# EAGLE design adcmp572-tdr-head (EAGLE 9.5.0)
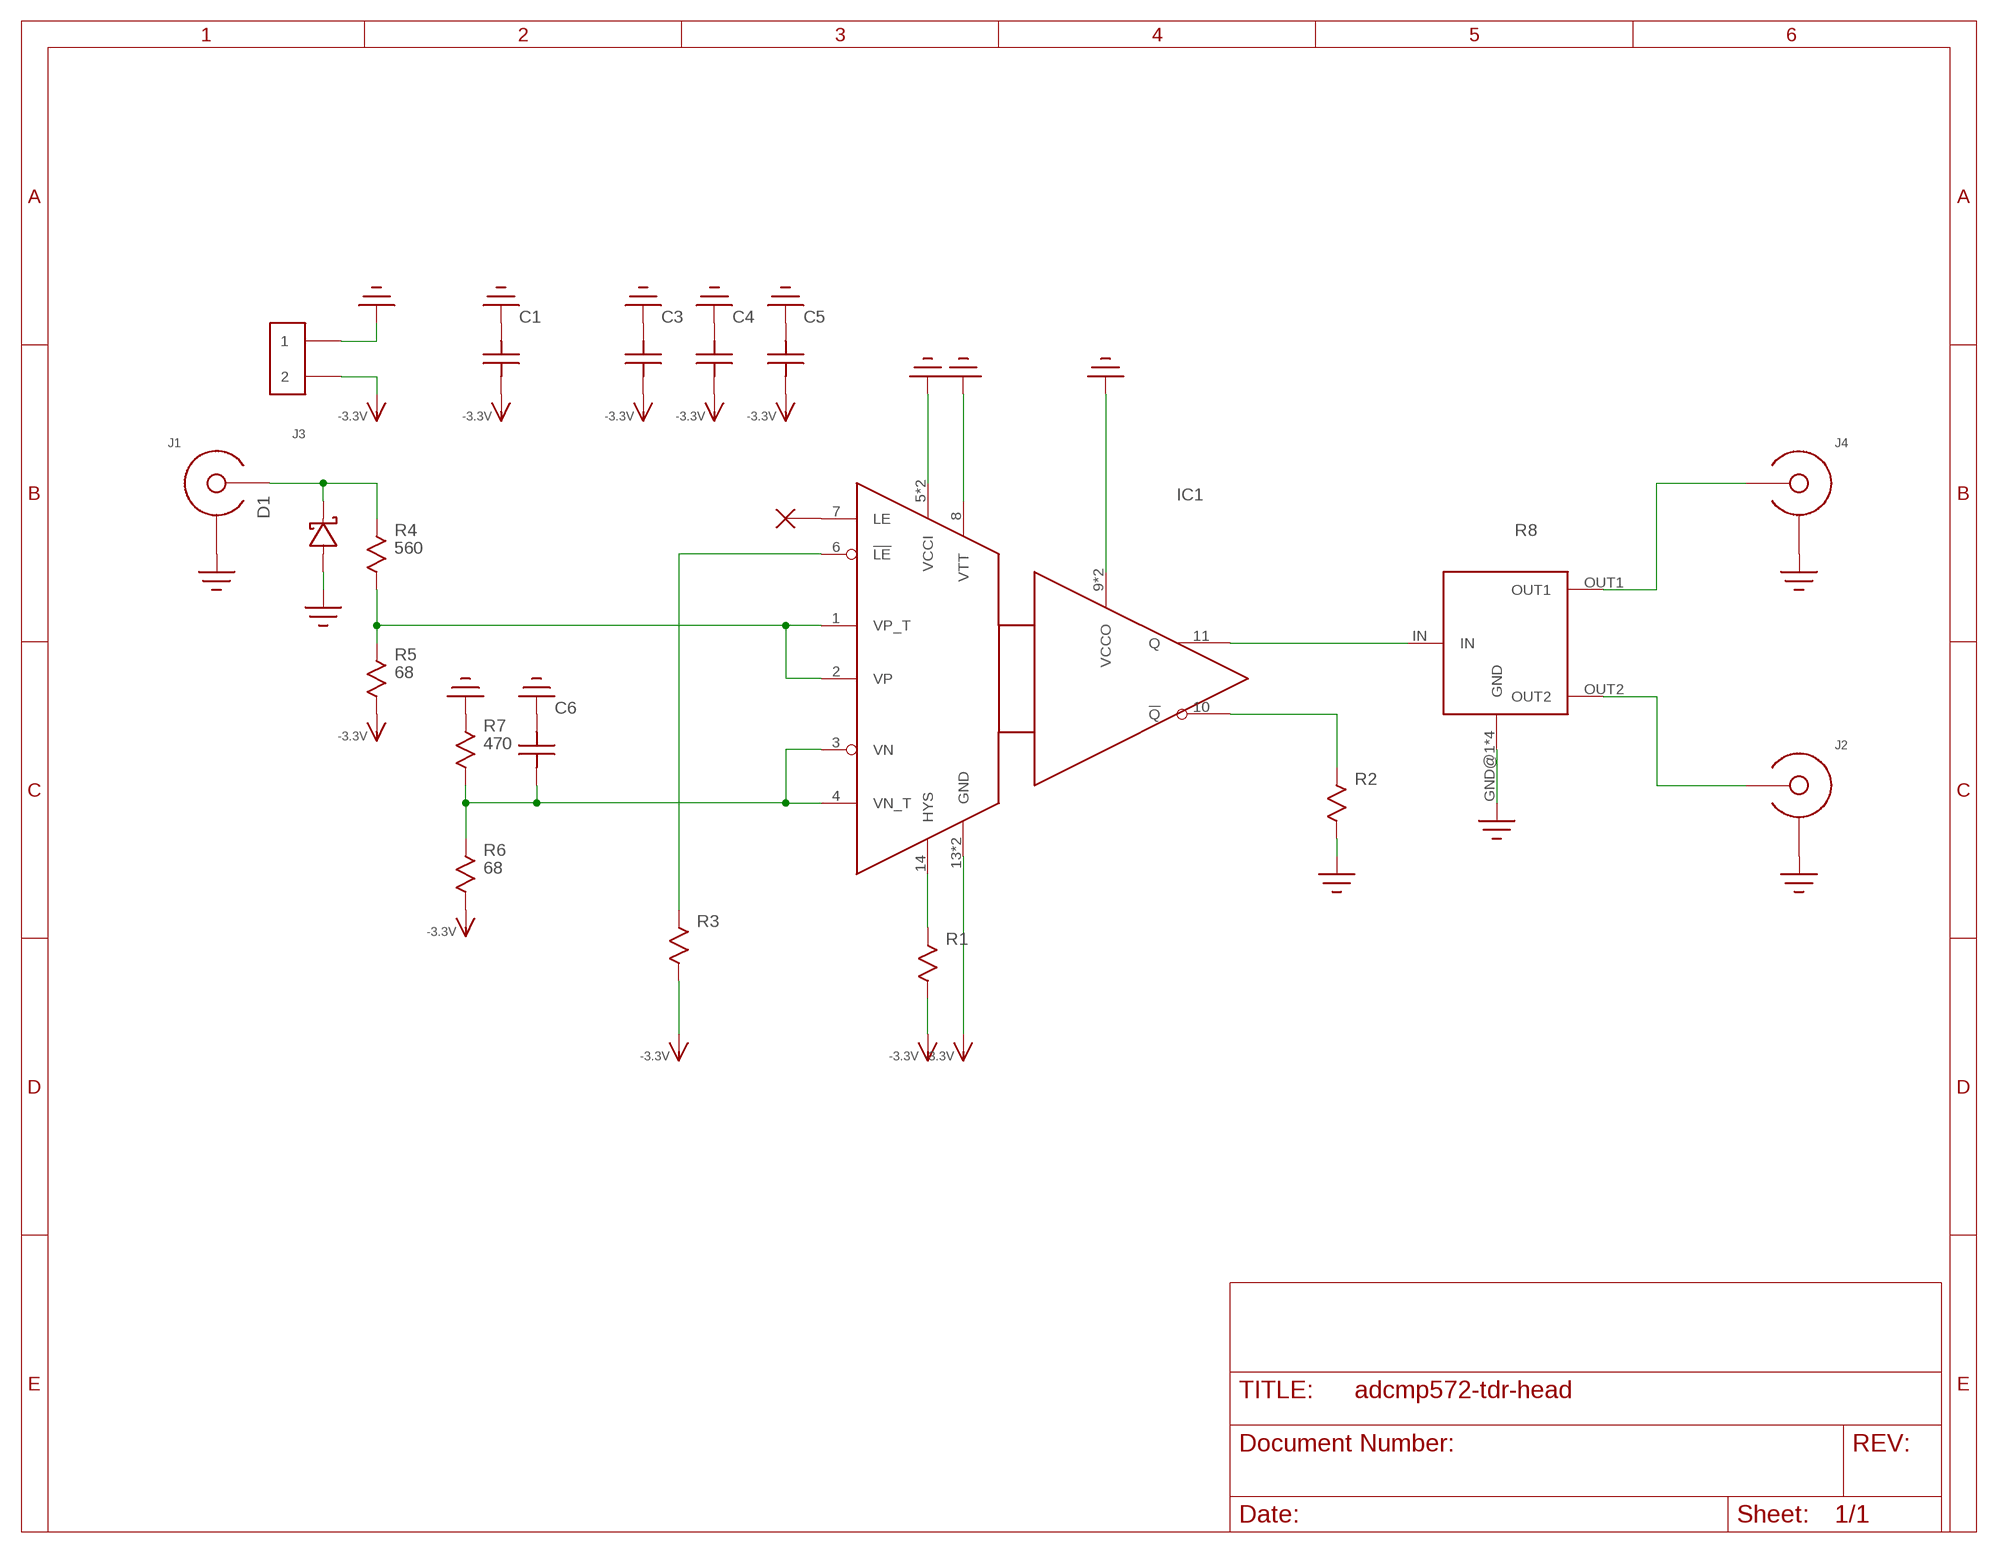
[diagram p0: schematic, sheet 1]

## Parts
C1  C1206  [1206]
C3  C0603  [C0603]
C4  C  [C0402]
C5  C  [C0402]
C6  C0603  [C0603]
D1  SCHOTTKYSOT-23  [SOT-23]
IC1  ADCMP572  [TQFN16-EP]
J1  SMA-EDGE-LAUNCH4020N5  [SMA_EDGE_LAUNCH_4L_4020_N5]
J2  SMA-EDGE-LAUNCH4020N5  [SMA_EDGE_LAUNCH_4L_4020_N5]
J3  HEADER_2PIN  [HEADER_2PIN]
J4  SMA-EDGE-LAUNCH4020N5  [SMA_EDGE_LAUNCH_4L_4020_N5]
R1  R0603  [R0603]
R2  R0402  [0402]
R3  R0603  [R0603]
R4  560  R0603  [R0603]
R5  68  R0603  [R0603]
R6  68  R0603  [R0603]
R7  470  R0603  [R0603]
R8  PS2012G-SPLITTER  [PS2012G-SPLITTER]
U$8  NO_CONNECT  (no package)

## Nets
-3.3V: C1.P$1 C3.P$1 C4.1 C5.1 IC1.13(GND) IC1.15(GND) J3.2 R1.P$2 R3.P$2 R5.P$2 R6.P$2
GND: C1.P$2 C3.P$2 C4.2 C5.2 C6.P$2 D1.1(ANODE) IC1.5(VCCI) IC1.8(VTT) IC1.9(VCCO) IC1.12(VCCO) IC1.16(VCCI) J1.BOTTOM_GND(SHIELD) J1.GND@1(SHIELD) J1.GND@2(SHIELD) J1.GND@3(SHIELD) J1.GND@4(SHIELD) J1.GND@5(SHIELD) J1.GND@6(SHIELD) J1.GND@7(SHIELD) J1.GND@8(SHIELD) J1.GND@9(SHIELD) J1.GND@10(SHIELD) J1.GND@14(SHIELD) J1.GND@15(SHIELD) J1.GND@16(SHIELD) J1.GND@17(SHIELD) J1.GND_PAD1(SHIELD) J1.GND_PAD2(SHIELD) J1.P$1(SHIELD) J1.P$2(SHIELD) J1.P$3(SHIELD) J1.P$4(SHIELD) J1.P$5(SHIELD) J2.BOTTOM_GND(SHIELD) J2.GND@1(SHIELD) J2.GND@2(SHIELD) J2.GND@3(SHIELD) J2.GND@4(SHIELD) J2.GND@5(SHIELD) J2.GND@6(SHIELD) J2.GND@7(SHIELD) J2.GND@8(SHIELD) J2.GND@9(SHIELD) J2.GND@10(SHIELD) J2.GND@14(SHIELD) J2.GND@15(SHIELD) J2.GND@16(SHIELD) J2.GND@17(SHIELD) J2.GND_PAD1(SHIELD) J2.GND_PAD2(SHIELD) J2.P$1(SHIELD) J2.P$2(SHIELD) J2.P$3(SHIELD) J2.P$4(SHIELD) J2.P$5(SHIELD) J3.1 J4.BOTTOM_GND(SHIELD) J4.GND@1(SHIELD) J4.GND@2(SHIELD) J4.GND@3(SHIELD) J4.GND@4(SHIELD) J4.GND@5(SHIELD) J4.GND@6(SHIELD) J4.GND@7(SHIELD) J4.GND@8(SHIELD) J4.GND@9(SHIELD) J4.GND@10(SHIELD) J4.GND@14(SHIELD) J4.GND@15(SHIELD) J4.GND@16(SHIELD) J4.GND@17(SHIELD) J4.GND_PAD1(SHIELD) J4.GND_PAD2(SHIELD) J4.P$1(SHIELD) J4.P$2(SHIELD) J4.P$3(SHIELD) J4.P$4(SHIELD) J4.P$5(SHIELD) R2.2 R7.P$1 R8.GND@1(GND) R8.GND@2(GND) R8.GND@3(GND) R8.GND@4(GND)
N$1: IC1.14(HYS) R1.P$1
N$2 [13.4-6]: IC1.10(!Q!) R2.1
N$3: C6.P$1 IC1.3(VN) IC1.4(VN_T) R6.P$1 R7.P$2
N$4: IC1.1(VP_T) IC1.2(VP) R4.P$2 R5.P$1
N$5: IC1.6(!LE!) R3.P$1
N$6: IC1.7(LE) U$8.P$1
N$7 [13.4-6]: IC1.11(Q) R8.IN
N$8 [13.4-6]: D1.3(CATHODE) J1.CENTER@1(CENTER) J1.CENTER@2(CENTER) R4.P$1
N$9 [13.4-6]: J4.CENTER@1(CENTER) J4.CENTER@2(CENTER) R8.OUT1
N$10 [13.4-6]: J2.CENTER@1(CENTER) J2.CENTER@2(CENTER) R8.OUT2

## Library data of the parts
C1 C3-C6 = yapo:C
D1 = yapo:SCHOTTKY
IC1 = yapo:ADCMP572
J1 J2 J4 = sma-temp:SMA-EDGE-LAUNCH
J3 = yapo:HEADER_2PIN
R1-R7 = yapo:R
R8 = yapo:PS2012G-SPLITTER
U$8 = yapo:NO_CONNECT

## Net classes
1 13.4-6: width 0.34 mm, clearance 0.152 mm

## Board
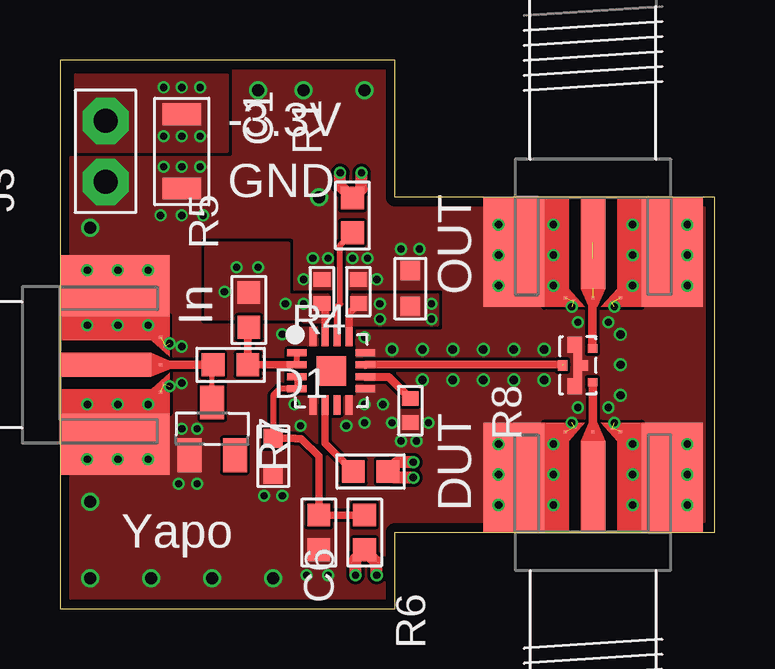
[diagram p1: board, top side]
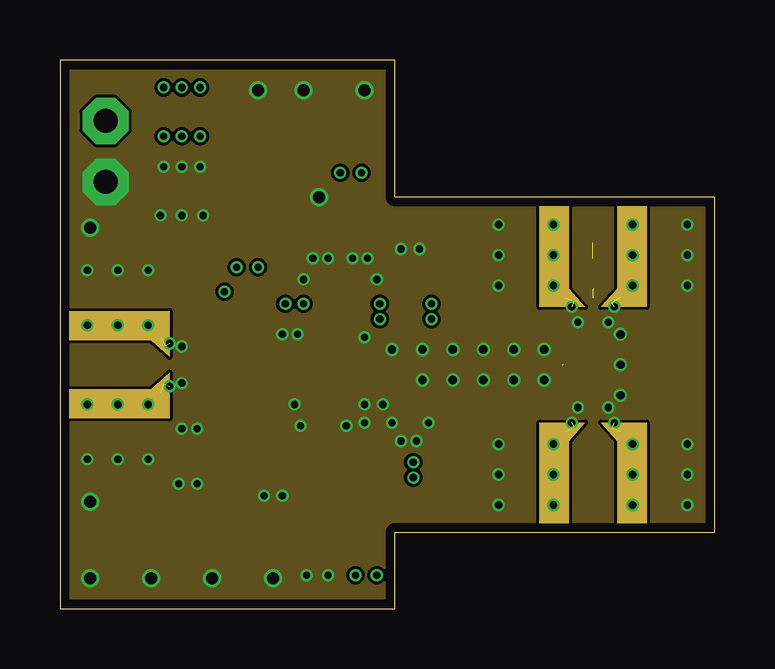
[diagram p2: board, inner layer Route2]
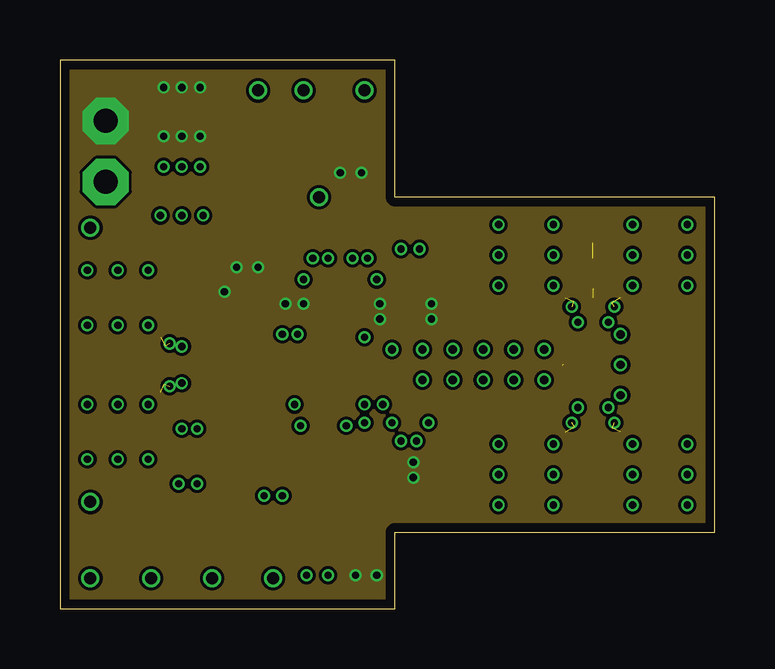
[diagram p3: board, inner layer Route15]
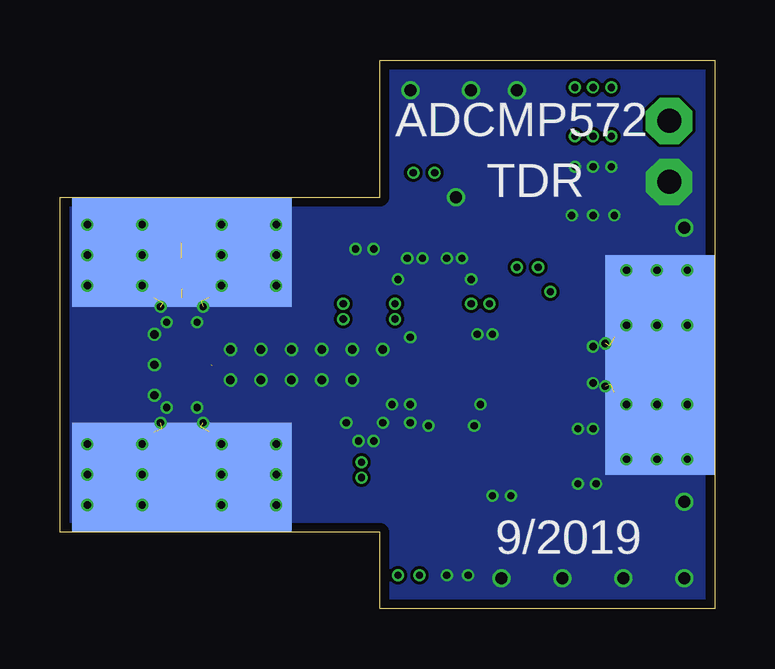
[diagram p4: board, bottom side, seen from below]

Size 27.3 x 22.86 mm. Coordinates in mm from the lower left corner, seen from the top.
Outline: 0,0 13.97,0 13.97,3.17 27.3,3.17 27.3,17.14 13.97,17.14 13.97,22.86 0,22.86 0,0
Copper layers (1*2*15*16): Top 0.035559375mm / dielectric 0.17018125mm / Route2 0.01778125mm / dielectric 47mil / Route15 0.01778125mm / dielectric 0.17018125mm / Bottom 0.035559375mm
Design rules "oshpark-4layer *": minimum track width 5mil, minimum drill 10mil, track to track 5mil, track to pad 5mil, pad to pad 5mil, via to via 5mil, smd to smd 5mil, copper to edge 15mil, drill to drill 6mil, minimum pad ring 4mil, minimum via ring 4mil, stop-mask expansion 2.5mil, vias tented up to drill 20mil, thermal gap 10mil

### Footprints (pad centres in the part's own frame; a part is rotated, then mirrored left to right if it is on the bottom)
1206 = smd 0.9 x 1.6: P$1 -1.55,0; P$2 1.55,0
C0603 = smd 0.8 x 0.8: P$1 -0.75,0; P$2 0.75,0
C0402 = smd 0.6 x 0.7: 1 -0.5,0; 2 0.5,0
SOT-23 = smd 1 x 1.4: 1 -0.95,-1.1; 2 0.95,-1.1; 3 0,1.1
TQFN16-EP = smd 0.3 x 0.8: 1 -0.75,-1.425; 2 -0.25,-1.425; 3 0.25,-1.425; 4 0.75,-1.425; 9 0.75,1.425; 10 0.25,1.425; 11 -0.25,1.425; 12 -0.75,1.425 | smd 0.8 x 0.3: 5 1.425,-0.75; 6 1.425,-0.25; 7 1.425,0.25; 8 1.425,0.75; 13 -1.425,0.75; 14 -1.425,0.25; 15 -1.425,-0.25; 16 -1.425,-0.75 | smd 1.23 x 1.23: EP 0,0
SMA_EDGE_LAUNCH_4L_4020_N5 = smd 4.572 x 9.144 bottom: BOTTOM_GND 2.286,0 | smd 3.81 x 1.016: CENTER@1 1.905,0 | smd 0.127 x 0.127: CENTER@2 4.191,0; P$1 4.191,1.143; P$2 4.191,-1.143; P$3 4.191,1.143; P$4 4.394,0.787; P$5 4.343,-0.813 | drill 0.3: GND@1 1.143,3.937; GND@2 3.683,3.937; GND@3 1.143,1.651; GND@4 3.683,1.651; GND@5 1.143,-1.651; GND@6 3.683,-1.651; GND@7 1.143,-3.937; GND@8 3.683,-3.937; GND@9 4.572,0.889; GND@10 4.572,-0.889; GND@14 2.413,3.937; GND@15 2.413,-3.937; GND@16 2.413,-1.651; GND@17 2.413,1.651 | smd 4.572 x 2.54: GND_PAD1 2.286,3.302; GND_PAD2 2.286,-3.302
HEADER_2PIN = drill 1 pad 1.93 octagon: 1 -1.27,0; 2 1.27,0
R0603 = smd 0.95 x 0.95: P$1 -0.725,0; P$2 0.725,0
0402 = smd 0.6 x 0.7: 1 -0.5,0; 2 0.5,0
PS2012G-SPLITTER = smd 0.675 x 0.6: GND@1 -0.863,-0.7; GND@3 0.863,-0.7 | smd 1.05 x 0.35: GND@2 0,-0.825 | smd 0.45 x 0.25: GND@4 0,-1.125 | smd 0.45 x 0.4: IN 0,-0.2 | smd 0.35 x 0.4: OUT1 -0.7,-1.45; OUT2 0.7,-1.45

### Placement (x,y rotation side)
C1  5.08,19.05 270 top
C3  14.61,13.34 90 top
C4  10.92,13.21 90 top
C5  12.45,13.21 90 top
C6  8.89,6.35 270 top
D1  6.35,7.49 0 top
IC1  11.3,9.91 270 top
J1  0,10.16 0 top
J2  22.23,17.14 270 top
J3  1.91,19.05 90 top
J4  22.23,3.17 90 top
R1  12.19,16.38 90 top
R2  14.61,8.26 270 top
R3  12.95,5.71 0 top
R4  7.11,10.16 0 top
R5  7.87,12.45 90 top
R6  12.7,3.17 270 top
R7  10.79,3.17 90 top
R8  20.75,10.13 90 top

### Tracks (layer width: path | path; a pad name or v marks a point on that pad's centre or on a via)
-3.3V  (via drill 0.3)
  Top 0.305: IC1.15 11.05,12.58 C4.1 | IC1.13 12.05,12.31 C5.1
  Top 0.508: v12.32,1.4 12.32,2.07 R6.P$2 13.21,1.94 v13.21,1.4 | v14.73,6.1 14.06,6.1 R3.P$2 13.93,5.46 v14.73,5.46 | v11.68,18.16 11.68,17.62 R1.P$2 12.57,17.49 v12.57,18.16
  other vias: 13.34,12.7 10.16,12.7 9.4,12.7 13.34,12.06 15.49,12.7 15.49,12.06 8.26,14.22 7.37,14.22 6.86,13.21 5.08,19.68 5.84,19.68 4.32,19.68 4.32,21.72 5.08,21.72 5.84,21.72
  pour Top (no thermals): 6.1,12.06 6.1,15.24 9.53,15.24 9.53,13.08 11.18,13.08 11.18,11.94 10.16,11.94 10.16,12.06
  pour Top (no thermals): 12.19,13.08 15.75,13.08 15.75,11.81 12.19,11.81
  pour Top (no thermals): 0.64,19.05 6.99,19.05 6.99,22.23 0.64,22.23
  pour Route15 (no thermals): 0,0 13.97,0 13.97,3.17 27.3,3.17 27.3,17.14 13.97,17.14 13.97,22.86 0,22.86
GND  (via drill 0.3, 0.35, 0.5)  (12 unrouted)
  other vias: 12.7,11.3 9.91,11.43 10.03,7.62 11.94,7.62 12.7,8.51 9.27,11.43 13.46,8.51 9.78,8.51 5.71,7.49 5.08,7.49 4.95,5.21 5.71,5.21 8.51,4.7 9.27,4.7 10.29,1.4 11.18,1.4 11.18,14.61 10.54,14.61 12.19,14.61 12.83,14.61 12.7,7.75 14.22,14.99 14.99,14.99 13.84,7.75 15.37,7.75 14.22,6.99 14.86,6.99 10.16,13.72 13.21,13.72 5.08,18.41 5.84,18.41 4.32,18.41 4.19,16.38 5.08,16.38 5.97,16.38 5.08,10.92 5.08,9.4 12.7,21.59 10.16,21.59 8.26,21.59 1.27,1.27 1.27,4.45 3.81,1.27 6.35,1.27 8.89,1.27 10.79,17.14 1.27,15.88 18.92,10.79 21.59,11.94 22.86,11.94 22.86,8.38 21.59,8.38 18.92,9.53 17.65,9.53 20.19,10.79 20.19,9.53 17.65,10.79 16.38,10.79 15.11,10.79 16.38,9.53 15.11,9.53 13.84,10.79 23.37,11.43 23.37,8.89 23.37,10.16
  pour Top (rank 2, no thermals): 0,0 13.97,0 13.97,3.17 27.3,3.17 27.3,17.14 13.97,17.14 13.97,22.86 0,22.86
  pour Route2 (no thermals): 0,0 13.97,0 13.97,3.17 27.3,3.17 27.3,17.14 13.97,17.14 13.97,22.86 0,22.86
  pour Bottom (no thermals): 0,0 13.97,0 13.97,3.17 27.3,3.17 27.3,17.14 13.97,17.14 13.97,22.86 0,22.86
  cutout Top (no thermals): 10.29,10.92 10.29,8.89 12.32,8.89 12.32,10.92
N$1
  Top 0.254: IC1.14 11.55,12.57 11.68,12.7 11.68,15.15 R1.P$1
N$2
  Top 0.34: IC1.10 13.7,9.66 R2.1
N$3
  Top 0.254: IC1.3 IC1.4 9.16,9.16 8.89,8.89 C6.P$1
  Top 0.305: C6.P$1 9.8,7.1 9.81,7.09 10.06,7.09 10.79,6.35 R7.P$2 R6.P$1
N$4
  Top 0.254: IC1.2 IC1.1
  Top 0.305: IC1.2 R4.P$2
  Top 0.34: R4.P$2 7.84,11.68 R5.P$1
N$5
  Top 0.305: IC1.6 11.05,6.89 R3.P$1
N$7  (1 unrouted)
  Top 0.34: 21,10.16 IC1.11
N$8
  Top 0.152: 6.35,10.16 R4.P$1
  Top 0.203: D1.3 6.35,10.16
  Top 0.344: R4.P$1 J1.CENTER@2 J1.CENTER@1
N$9
  Top 0.344: R8.OUT1 22.23,9.44 J4.CENTER@2 J4.CENTER@1
N$10  (2 unrouted)
  Top 0.344: R8.OUT2 22.2,13.34 22.23,13.34 | J2.CENTER@2 22.23,14.61

### Text on the board
tPlace: -3.3V | GND | OUT | In | DUT | Yapo
bPlace: ADCMP572 | TDR | 9/2019